# EAGLE schematic esp32 m5 shield (EAGLE 9.6.2)
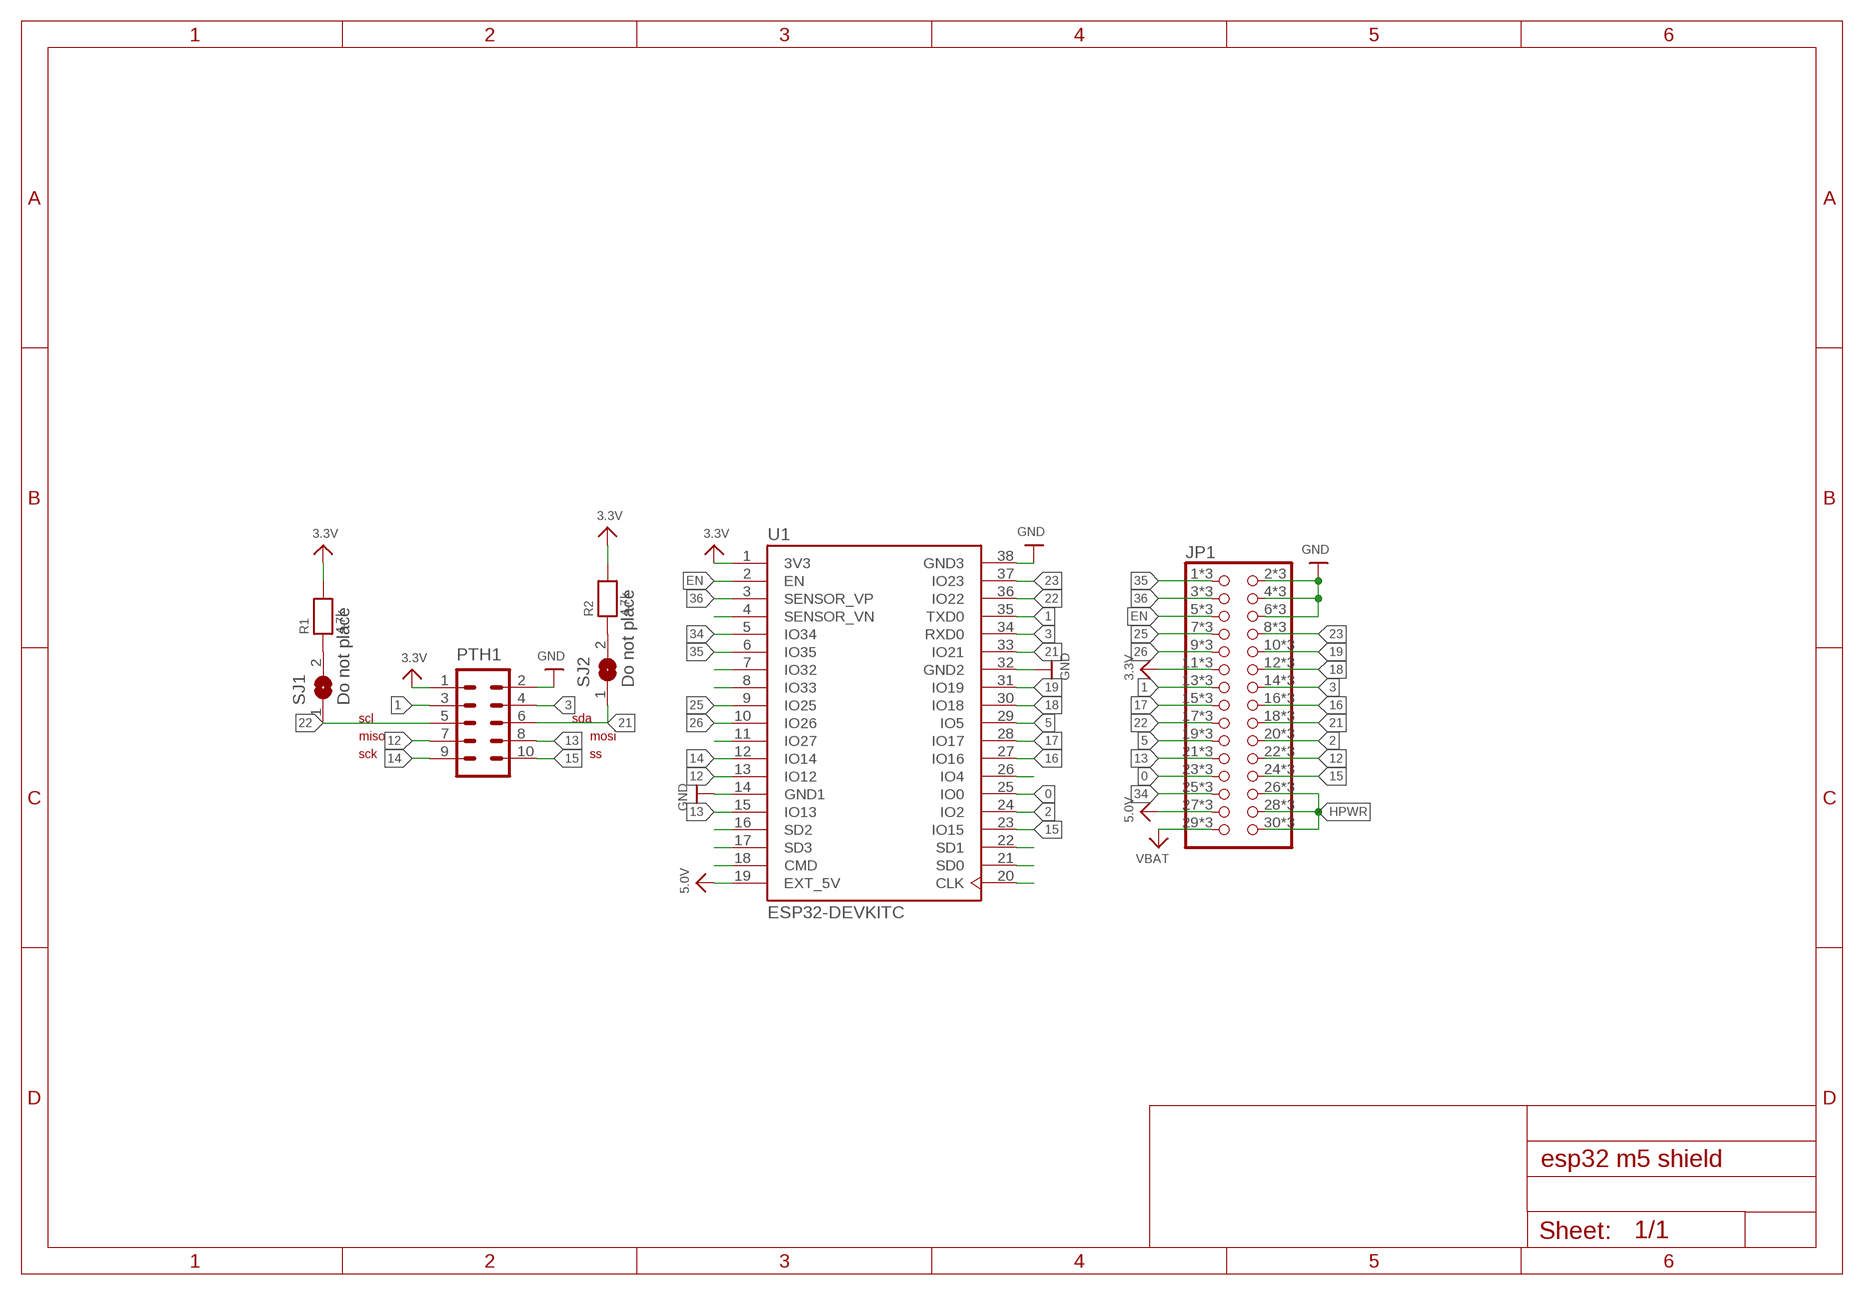
[diagram p0: schematic, sheet 1]

## Parts
JP1  PINHD-2X15  [2X15]
PTH1  ML10PTH  [ML10-MALE]
R1  4.7k  RESISTOR0603MINI  [0603-MINI]
R2  4.7k  RESISTOR0603MINI  [0603-MINI]
SJ1  Do not place  SOLDERJUMPERCLOSED  [SOLDERJUMPER_CLOSEDWIRE]
SJ2  Do not place  SOLDERJUMPERCLOSED  [SOLDERJUMPER_CLOSEDWIRE]
U1  ESP32-DEVKITC  [MODULE_ESP32-DEVKITC]

## Nets
0: JP1.23 JP1.P$23 JP1.P$53 U1.25(IO0)
1: JP1.13 JP1.P$13 JP1.P$43 PTH1.3 U1.35(TXD0)
2: JP1.20 JP1.P$20 JP1.P$50 U1.24(IO2)
3: JP1.14 JP1.P$14 JP1.P$44 PTH1.4 U1.34(RXD0)
3.3V: JP1.11 JP1.P$11 JP1.P$41 PTH1.1 R1.2 R2.2 U1.1(3V3)
5: JP1.19 JP1.P$19 JP1.P$49 U1.29(IO5)
5.0V: JP1.27 JP1.P$27 JP1.P$57 U1.19(EXT_5V)
12: JP1.22 JP1.P$22 JP1.P$52 PTH1.7 U1.13(IO12)
13: JP1.21 JP1.P$21 JP1.P$51 PTH1.8 U1.15(IO13)
14: PTH1.9 U1.12(IO14)
15: JP1.24 JP1.P$24 JP1.P$54 PTH1.10 U1.23(IO15)
16: JP1.16 JP1.P$16 JP1.P$46 U1.27(IO16)
17: JP1.15 JP1.P$15 JP1.P$45 U1.28(IO17)
18: JP1.12 JP1.P$12 JP1.P$42 U1.30(IO18)
19: JP1.10 JP1.P$10 JP1.P$40 U1.31(IO19)
21: JP1.18 JP1.P$18 JP1.P$48 PTH1.6 SJ2.1 U1.33(IO21)
22: JP1.17 JP1.P$17 JP1.P$47 PTH1.5 SJ1.1 U1.36(IO22)
23: JP1.8 JP1.P$8 JP1.P$38 U1.37(IO23)
25: JP1.7 JP1.P$7 JP1.P$37 U1.9(IO25)
26: JP1.9 JP1.P$9 JP1.P$39 U1.10(IO26)
34: JP1.25 JP1.P$25 JP1.P$55 U1.5(IO34)
35: JP1.1 JP1.P$1 JP1.P$31 U1.6(IO35)
36: JP1.3 JP1.P$3 JP1.P$33 U1.3(SENSOR_VP)
EN: JP1.5 JP1.P$5 JP1.P$35 U1.2(EN)
GND: JP1.2 JP1.4 JP1.6 JP1.P$2 JP1.P$4 JP1.P$6 JP1.P$32 JP1.P$34 JP1.P$36 PTH1.2 U1.14(GND1) U1.32(GND2) U1.38(GND3)
HPWR: JP1.26 JP1.28 JP1.30 JP1.P$26 JP1.P$28 JP1.P$30 JP1.P$56 JP1.P$58 JP1.P$60
N$1: R1.1 SJ1.2
N$2: R2.1 SJ2.2
N$13: U1.26(IO4)
N$20: U1.22(SD1)
N$21: U1.21(SD0)
N$22: U1.20(CLK)
N$25: U1.16(SD2)
N$26: U1.17(SD3)
N$27: U1.18(CMD)
N$30: U1.11(IO27)
N$36: U1.7(IO32)
N$37: U1.8(IO33)
N$43: U1.4(SENSOR_VN)
VBAT: JP1.29 JP1.P$29 JP1.P$59

## Notes on the sheet
- scl | sda
- miso | mosi
- sck | ss

## Library data of the parts
JP1 = pinhead:PINHD-2X15: PIN HEADER
PTH1 = UEXT:ML10: UEXT
R1 R2 = microbuilder:RESISTOR: Resistors 0402 - 0402 Surface Mount Package 22 Ohm 1% 1/16W [Digikey: 311-22.0LRTR-ND] 33 Ohm 5% 1/16W 1.0K 5% 1/16W 1.5K 5% 1/16W 2.0K 1% 1/16W 10.0K 1% 1/16W [Digikey: 311-10.0KLRTR-ND] 10.0K 5% 1/16W [Digikey: RMCF0402JT10K0TR-ND] 12.1K 1% 1/16W [Digikey: 311-22.0LRTR-ND] 100.0K 5% 1/16W 0603 - 0603 Surface Mount Package 0 Ohm 1/10 Watt 1% Resistor 15 Ohm 1/10 Watt 1% Resistor 33 Ohm 1/10 Watt 1% Resistor 49.9 Ohm 1/10 Watt 1% Resistor 100 Ohm 1/10 Watt 1% Resistor 150 Ohm 1/10 Watt 1% Resistor 240 Ohm 1/10 Watt 1% Resistor 390 Ohm 1/10 Watt 1% Resistor 560 Ohm 1/10 Watt 1% Resistor 680 Ohm 1/10 Watt 1% Resistor 750 Ohm 1/10 Watt 1% Resistor 1.0K Ohm 1/10 Watt 1% Resistor 1.5K Ohm 1/10 Watt 1% Resistor 2.0K Ohm 1/10 Watt 1% Resistor 2.2K Ohm 1/10 Watt 1% Resistor 3.3K Ohm 1/10 Watt 1% Resistor 4.7K Ohm 1/10 Watt 1% Resistor 10.0K Ohm 1/10 Watt 1% Resistor 12.0K Ohm 1/10 Watt 1% Resistor 12.1K Ohm 1/10 Watt 1% Resistor 20.0K Ohm 1/10 Watt 1% Resistor 33.0K Ohm 1/10 Watt 1% Resistor 100.0K Ohm 1/10 Watt 1% Resistor 0805 - 0805 Surface Mount Package 0 Ohm 1/8 Watt 1% Resistor 33 Ohm 1/8 Watt 1% Resistor 100 Ohm 1/8 Watt 1% Resistor 150 Ohm 1/8 Watt 1% Resistor 200 Ohm 1/8 Watt 1% Resistor 240 Ohm 1/8 Watt 1% Resistor 330 Ohm 1/8 Watt 1% Resistor 390 Ohm 1/8 Watt 1% Resistor 470 Ohm 1/8 Watt 1% Resistor 1.0K Ohm 1/8 Watt 1% Resistor 1.5K Ohm 1/8 Watt 1% Resistor 2.0K Ohm 1/8 Watt 1% Resistor 4.7K Ohm 1/8 Watt 1% Resistor 5.1K Ohm 1/8 Watt 1% Resistor 5.6K Ohm 1/8 Watt 1% Resistor 10.0K Ohm 1/8 Watt 1% Resistor 22.0K Ohm 1/8 Watt 1% Resistor 33.0K Ohm 1/8 Watt 1% Resistor 100K Ohm 1/8 Watt 1% Resistor 1206 - 1206 Surface Mount Package 2012 - 2010 Surface Mount Package 0.11 Ohm 1/2 Watt 1% Resistor - Digikey: RHM.11UCT-ND
SJ1 SJ2 = microbuilder:SOLDERJUMPER: SMD Solder JUMPER Solder the two pads together to create a connection, or remove the solder to break it. REFLOW - Use this footprint for solder paste and reflow ovens. WAVE - Use this footprint for hand-soldering (larger pads). CLOSED - Has a trace between the two pads to ensure it is closed by default. The trace needs to be cut to disable the jumper, and can be closed again by creating a solder bridge between the two pads.
U1 = ESP32-DEVKITC:ESP32-DEVKITC: ESP32-DEVKITC Check prices <https://pricing.snapeda.com/parts/ESP32-DEVKITC/Espressif%20Systems/view-part?ref=eda>; AVAILABILITY: In Stock; DESCRIPTION: ESP32-WROVER-IE series Transceiver; 802.11 b/g/n (Wi-Fi, WiFi, WLAN), Bluetooth® Smart Ready 4.x Dual Mode Evaluation Board; MF: Espressif Systems; MP: ESP32-DEVKITC; PACKAGE: None; PRICE: None; PURCHASE-URL: https://pricing.snapeda.com/search/part/ESP32-DEVKITC/?ref=eda